# EAGLE schematic visitor counter (EAGLE 7.6.0)
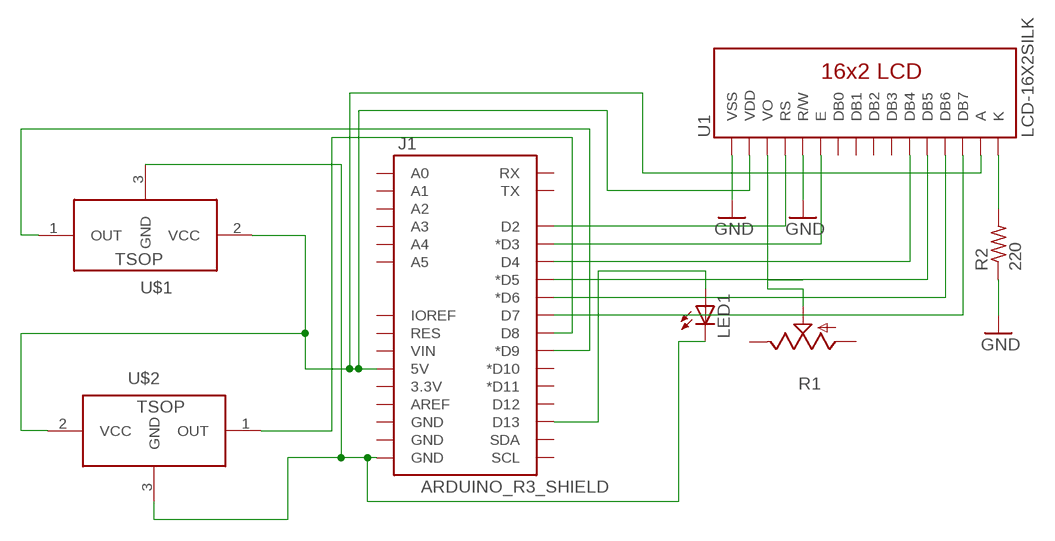
[diagram p0: schematic, sheet 1]

## Parts
J1  ARDUINO_R3_SHIELD  [UNO_R3_SHIELD]
LED1  LED5MM  [LED5MM]
R1  TRIM_US-CIP20C-4MM  [CIP20C-4MM]
R2  220  R-US_0204/7  [0204/7]
U1  LCD-16X2SILK  [LCD-16X2]
U$1  TSOP34X  [TSOP3XXX]
U$2  TSOP34X  [TSOP3XXX]

## Nets
GND: R2.1 U1.1(VSS) U1.5(R/W)
N$1: J1.GND@0(GND) LED1.K(C) U$1.3(GND) U$2.3(GND)
N$2: J1.D13 LED1.A
N$3: J1.5V U1.2(VDD) U1.15(A) U$1.2(VCC) U$2.2(VCC)
N$4: J1.D8 U$2.1(OUT)
N$5: J1.D9(*D9) U$1.1(OUT)
N$7: J1.D2 U1.4(RS)
N$8: J1.D3(*D3) U1.6(E)
N$9: J1.D4 U1.11(DB4)
N$10: J1.D5(*D5) U1.12(DB5)
N$11: J1.D6(*D6) U1.13(DB6)
N$12: J1.D7 U1.14(DB7)
N$13: R2.2 U1.16(K)
N$14: R1.S U1.3(VO)
Unconnected: J1.3.3V J1.A0 J1.A1 J1.A2 J1.A3 J1.A4 J1.A5 J1.AREF J1.D10(*D10) J1.D11(*D11) J1.D12 J1.GND@1(GND) J1.GND@2(GND) J1.IOREF J1.RES J1.RX J1.SCL J1.SDA J1.TX J1.VIN R1.A R1.E U1.7(DB0) U1.8(DB1) U1.9(DB2) U1.10(DB3)

## Library data of the parts
J1 = SparkFun-Boards:ARDUINO_R3_SHIELD: Shield form compatible with the Arduino Uno R3.
LED1 = Arduino_Hackathon_v5:LED
R1 = pot:TRIM_US-: POTENTIOMETER
R2 = Arduino_Hackathon_v5:R-US_: RESISTOR, American symbol
U1 = SparkFun-Displays:LCD-16X2: Standard text-only 16x2 parallel input LCD
U$1 U$2 = CEDT_JANUARY_2015_v5:TSOP34X: Vishay IR Reciever Product Page <http://www.vishay.com/product?docid=82489> Family -TSOP34XX Part by : Rohit Gupta